# EAGLE design CHIDIYA_UD_TALKING_V8 (EAGLE 9.2.2)
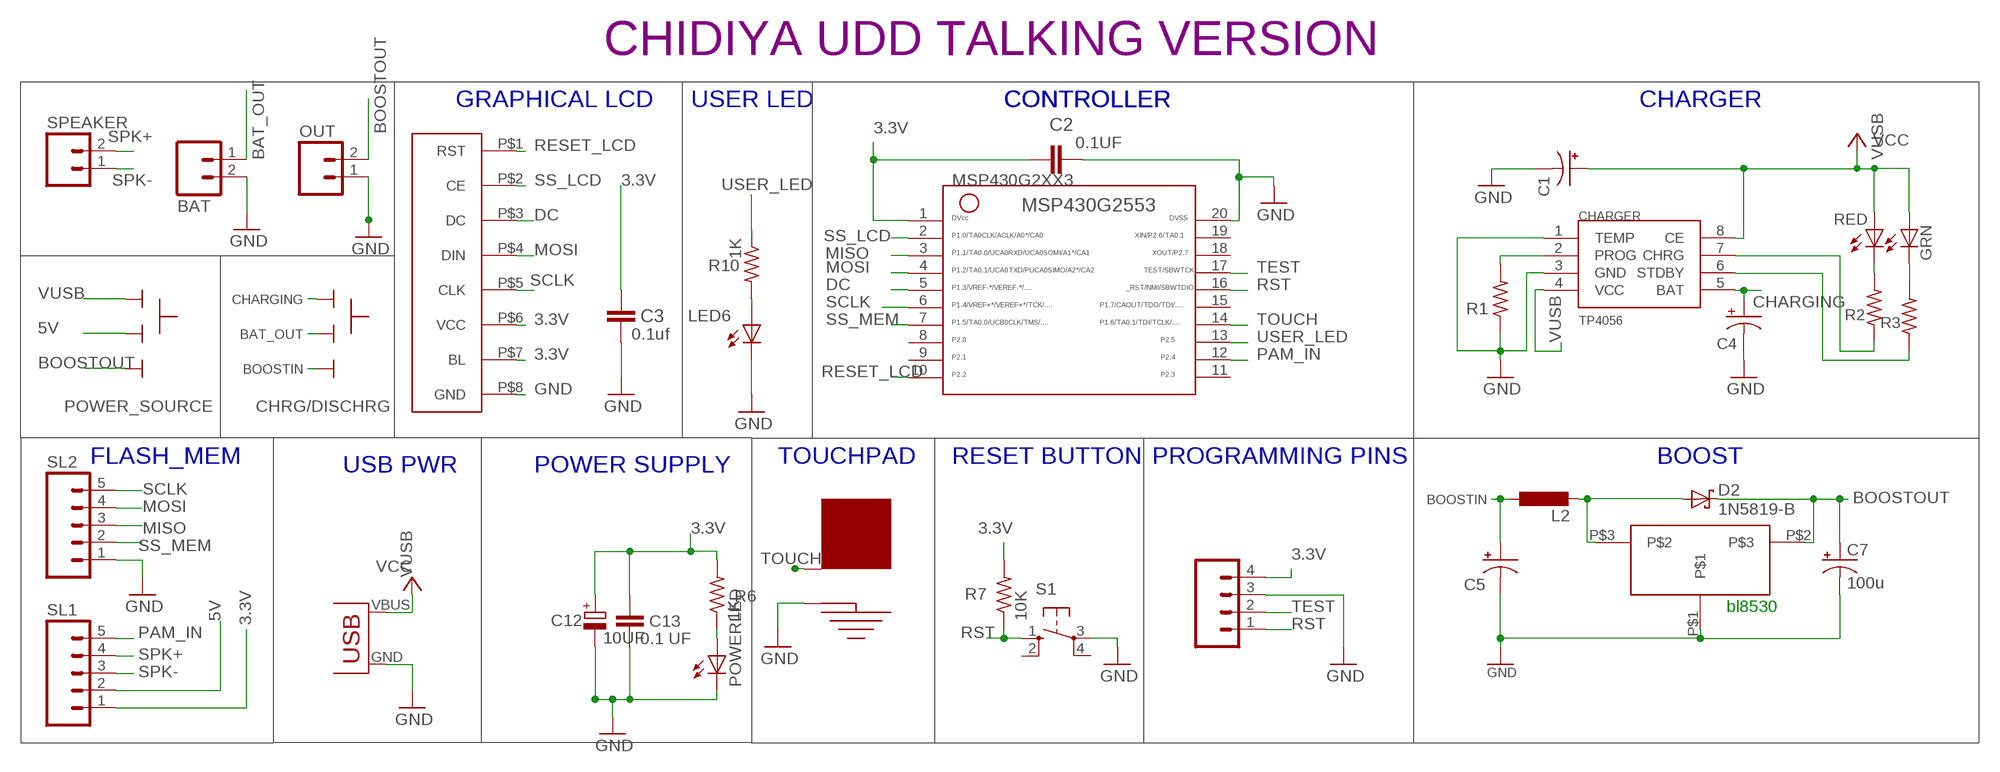
[diagram p0: schematic, sheet 1]

## Parts
BAT  M02  [02P]
BOOST  BL8530_5V  [BL8530_5V]
C1  10u  CAP_POL_10V  [C/6032-28R]
C2  0.1UF  C-EU050-025X075  [C050-025X075]
C3  0.1uf  C-EU025-025X050  [C025-025X050]
C4  10u  CAP_POL_10V  [C/6032-28R]
C5  10u  CAP_POL_10V  [C/6032-28R]
C7  100u  CAP_POL_10V  [C/6032-28R]
C12  10UF  CPOL-EUE2.5-5  [E2,5-5]
C13  0.1 UF  C-EU025-024X044  [C025-024X044]
CHARGER  TP4056  [SOP-8]
CHRG/DISCHRG  SLIDESWITCH-BIG  [BIGSWITCH]
D2  1N5819-B  [DO41-7.6]
GRN  LED3MM  [LED3MM]
L2  47uH  L-EUL4532P  [L4532P]
LED6  LED3MM  [LED3MM]
MSP430G2553  MSP430G2553DIP20  [G2553-DIP20]
OUT  M02  [02P]
POWER_SOURCE  SLIDESWITCH-BIG  [BIGSWITCH]
POWERLED  LED3MM  [LED3MM]
PROGRAM  M04  [04P]
R1  RESISTOR0805  [R0805]
R2  470  RESISTOR0805  [R0805]
R3  470  RESISTOR0805  [R0805]
R6  1K  R-US_0207/7  [0207/7]
R7  10K  R-US_0207/7  [0207/7]
R10  1K  R-US_0207/7  [0207/7]
RED  LED3MM  [LED3MM]
S1  10-XX  [B3F-10XX]
SL1  M05  [05P]
SL2  M05  [05P]
SPEAKER  M02  [02P]
TOUCH1  TOUCHPAD-20MM  [TOUCHPAD-20MM]
U$2  USB(POWER)  [USB(POWER)]
U$4  NOKIA_5110_LCD  [NOKIA_5110_MODULE]

## Nets
3.3V: C2.1 C3.1 C12.+ C13.1 MSP430G2553.1 PROGRAM.4 R6.2 R7.2 SL1.1 U$4.P$6(VCC) U$4.P$7(BL)
5V: POWER_SOURCE.2 SL1.2
BAT_OUT [Power]: BAT.1 CHRG/DISCHRG.2
BOOSTIN: C5.+ CHRG/DISCHRG.3 L2.1
BOOSTOUT [Power]: BOOST.P$2 C7.+ D2.C OUT.2 POWER_SOURCE.3
CHARGING: C4.+ CHARGER.5(BAT) CHRG/DISCHRG.1
DC: MSP430G2553.5 U$4.P$3(DC)
GND: BAT.2 BOOST.P$1 C1.- C2.2 C3.2 C4.- C5.- C7.- C12.- C13.2 CHARGER.1(TEMP) CHARGER.3(GND) LED6.K(C) MSP430G2553.20 OUT.1 POWERLED.K(C) PROGRAM.3 R1.1 S1.3(P) SL2.1 TOUCH1.GND U$2.GND U$4.P$8(GND)
MISO: MSP430G2553.3 SL2.3
MOSI: MSP430G2553.4 SL2.4 U$4.P$4(DIN)
N$5: LED6.A R10.2
N$7: CHARGER.2(PROG) R1.2
N$8: CHARGER.7(CHRG) R2.1
N$9: CHARGER.6(STDBY) R3.1
N$10: R2.2 RED.K(C)
N$11: BOOST.P$3 D2.A L2.2
N$12: POWERLED.A R6.1
N$15: GRN.K(C) R3.2
PAM_IN: MSP430G2553.12 SL1.5
RESET_LCD: MSP430G2553.10 U$4.P$1(RST)
RST: MSP430G2553.16 PROGRAM.1 R7.1 S1.1(S)
SCLK: MSP430G2553.6 SL2.5 U$4.P$5(CLK)
SPK+: SL1.4 SPEAKER.2
SPK-: SL1.3 SPEAKER.1
SS_LCD: MSP430G2553.2 U$4.P$2(CE)
SS_MEM: MSP430G2553.7 SL2.2
TEST: MSP430G2553.17 PROGRAM.2
TOUCH: MSP430G2553.14 TOUCH1.TOUCH
USER_LED: MSP430G2553.13 R10.1
VUSB [Power]: C1.+ CHARGER.4(VCC) CHARGER.8(CE) GRN.A POWER_SOURCE.1 RED.A U$2.VBUS(VCC) ; supply symbol labelled VCC
Unconnected: MSP430G2553.8 MSP430G2553.9 MSP430G2553.11 MSP430G2553.15 MSP430G2553.18 MSP430G2553.19 S1.2(S1) S1.4(P1)

## Notes on the sheet
- CHIDIYA UDD TALKING VERSION
- GRAPHICAL LCD | USER LED | CONTROLLER | CONTROLLER | CHARGER
- FLASH_MEM | TOUCHPAD | RESET BUTTON | PROGRAMMING PINS | BOOST
- USB PWR | POWER SUPPLY
- bl8530

## Library data of the parts
BAT OUT SPEAKER = CEDT_JANUARY_2015_v5:M02: AMP QUICK CONNECTOR
BOOST = PSU_TT_SMD:BL8530_5V
C1 C7 = CEDT_JANUARY_2015_v7:CAP_POL
C2 C13 = CPO:C-EU: CAPACITOR, European symbol
C3 = Arduino_Hackathon_v5:C-EU: CAPACITOR, European symbol
C4 C5 = CEDT_JANUARY_2015_v5:CAP_POL
C12 = rcl:CPOL-EU: POLARIZED CAPACITOR, European symbol; SPICEPREFIX: C
CHARGER = TP4056:TP4056
CHRG/DISCHRG POWER_SOURCE = CEDT_JANUARY_2015_v5:SLIDESWITCH
D2 = diode:1N581*: 1.0A SCHOTTKY BARRIER RECTIFIER Source: http://www.diodes.com/datasheets/ds23001.pdf
GRN RED = 01_adafruit:LED: LED OSRAM: - CHIPLED LG R971, LG N971, LY N971, LG Q971, LY Q971, LO R971, LY R971 LH N974, LH R974 LS Q976, LO Q976, LY Q976 LO Q996 - Hyper CHIPLED LW Q18S LB Q993, LB Q99A, LB R99A - SideLED LS A670, LO A670, LY A670, LG A670, LP A670 LB A673, LV A673, LT A673, LW A673 LH A674 LY A675 LS A676, LA A676, LO A676, LY A676, LW A676 LS A679, LY A679, LG A679 - Hyper Micro SIDELED® LS Y876, LA Y876, LO Y876, LY Y876 LT Y87S - SmartLED LW L88C, LW L88S LB L89C, LB L89S, LG L890 LS L89K, LO L89K, LY L89K LS L896, LA L896, LO L896, LY L896 - TOPLED LS T670, LO T670, LY T670, LG T670, LP T670 LSG T670, LSP T670, LSY T670, LOP T670, LYG T670 LG T671, LOG T671, LSG T671 LB T673, LV T673, LT T673, LW T673 LH T674 LS T676, LA T676, LO T676, LY T676, LB T676, LH T676, LSB T676, LW T676 LB T67C, LV T67C, LT T67C, LS T67K, LO T67K, LY T67K, LW E67C LS E67B, LA E67B, LO E67B, LY E67B, LB E67C, LV E67C, LT E67C LW T67C LS T679, LY T679, LG T679 LS T770, LO T770, LY T770, LG T770, LP T770 LB T773, LV T773, LT T773, LW T773 LH T774 LS E675, LA E675, LY E675, LS T675 LS T776, LA T776, LO T776, LY T776, LB T776 LHGB T686 LT T68C, LB T68C - Hyper Mini TOPLED® LB M676 - Mini TOPLED Santana® LG M470 LS M47K, LO M47K, LY M47K Source: http://www.osram.convergy.de/
L2 = rcl:L-EU: INDUCTOR, European symbol
LED6 POWERLED = CEDT_JANUARY_2015_v5:LED
MSP430G2553 = CEDT_JANUARY_2015_v5:MSP430G2553
PROGRAM = con-amp-quick:M04: AMP QUICK CONNECTOR; OC_FARNELL: unknown; OC_NEWARK: unknown
R1-R3 = CEDT_JANUARY_2015_v5:RESISTOR
R6 R7 R10 = rcl:R-US_: RESISTOR, American symbol; SPICEPREFIX: R
S1 = switch-omron:10-XX: OMRON SWITCH; MPN: B3F-1000; OC_FARNELL: 176432; OC_NEWARK: 36M3542
SL1 SL2 = con-amp-quick:M05: AMP QUICK CONNECTOR; OC_FARNELL: unknown; OC_NEWARK: unknown
TOUCH1 = modified_msp_framework_v3:TOUCHPAD
U$2 = CEDT_JANUARY_2015_v7:USB(POWER)
U$4 = CEDT_SEPTEMBER_V2:NOKIA_5110_LCD

## Net classes
0 default: width 0.356 mm
1 Power: width 0.508 mm

## Board
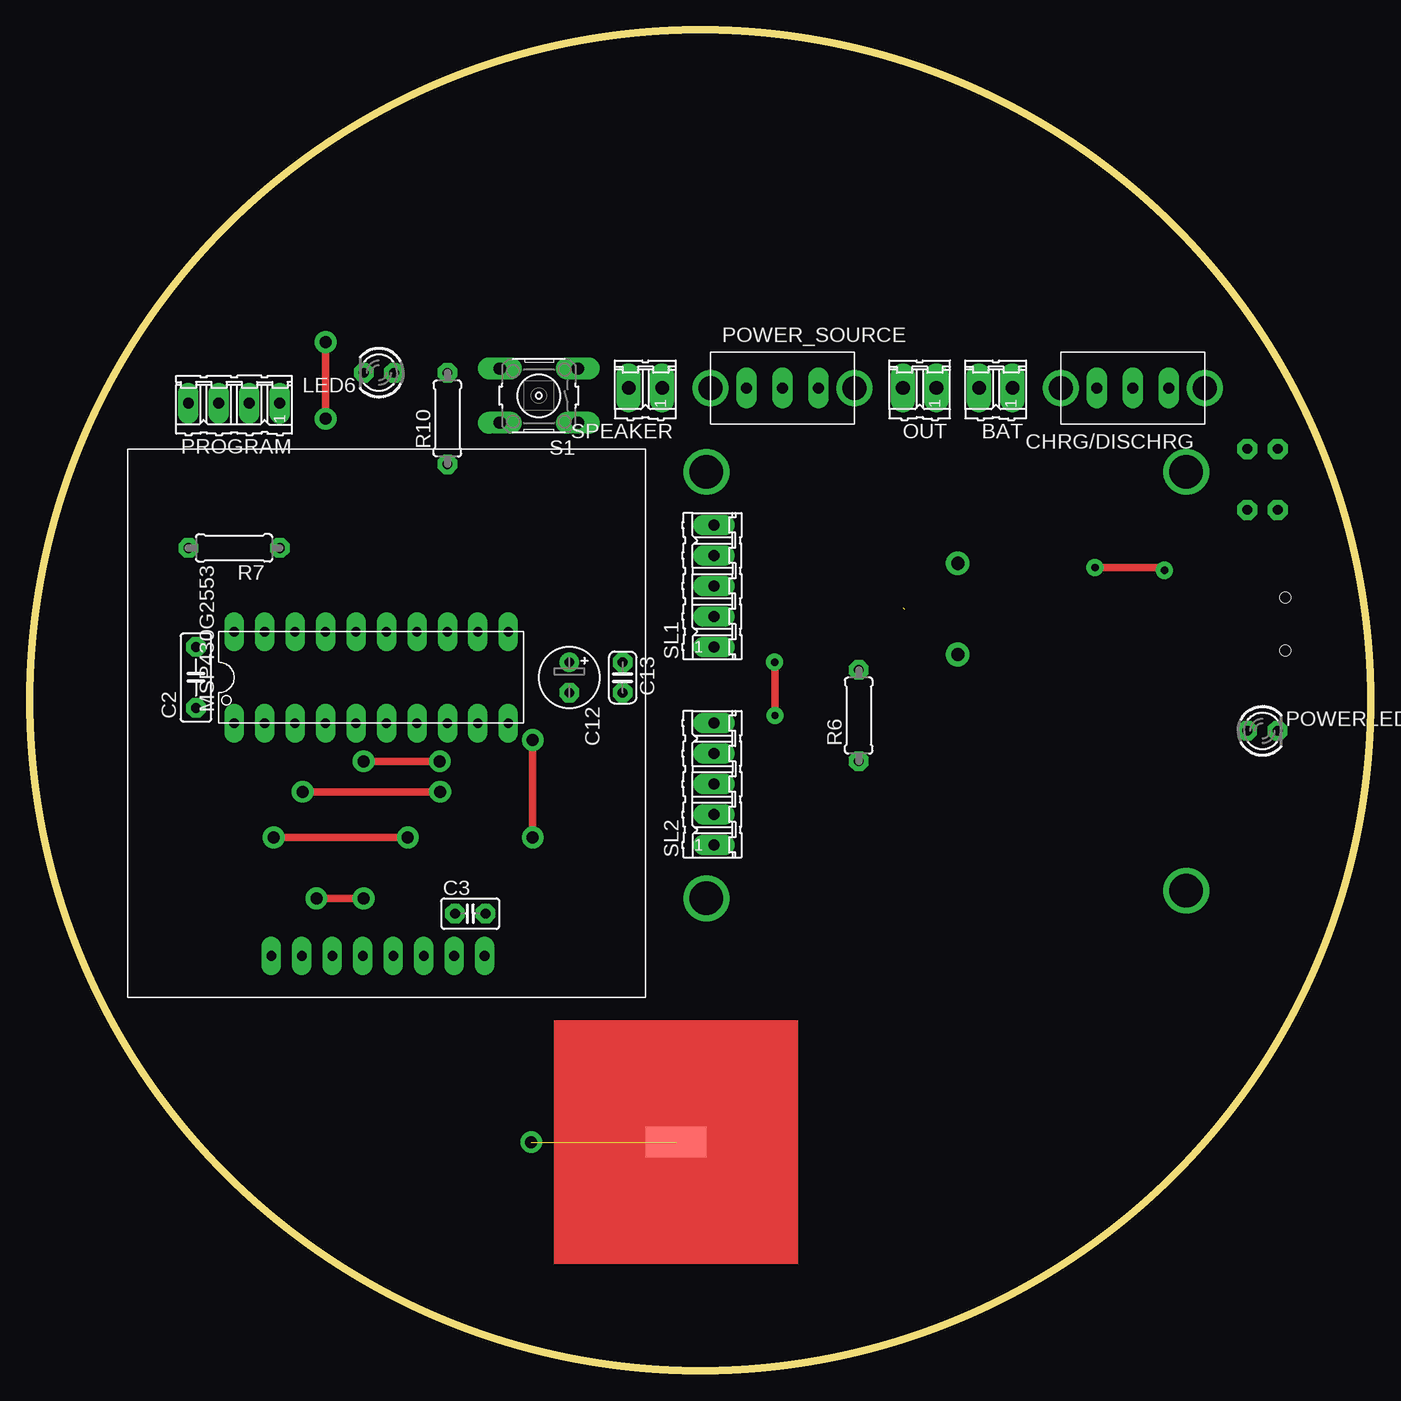
[diagram p1: board, top side]
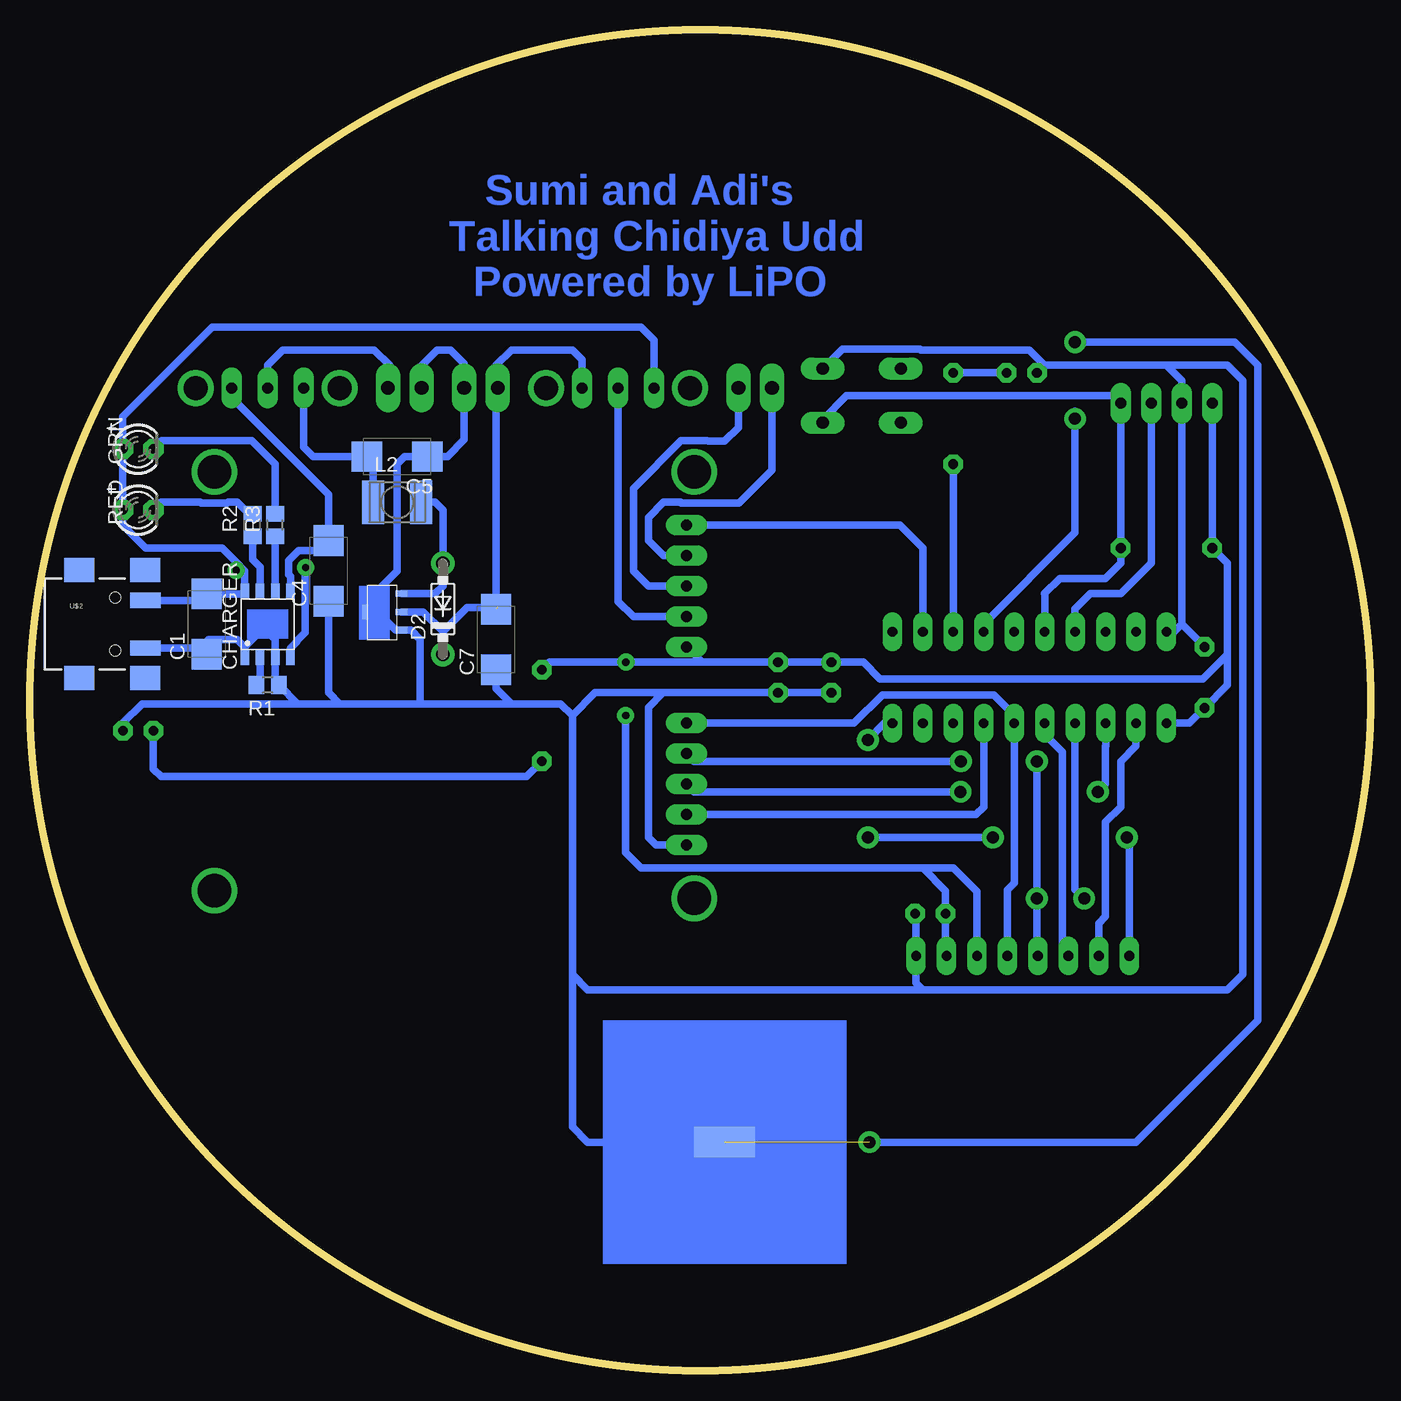
[diagram p2: board, bottom side, seen from below]

Size 111.76 x 111.76 mm. Coordinates in mm from the lower left corner, seen from the top.
Outline: circle at 55.88,55.88 radius 55.88
Copper layers (1*16): Top 0.035mm / dielectric 1.5mm / Bottom 0.035mm
Design rules "default *": minimum track width 24mil, minimum drill 24mil, track to track 16mil, track to pad 16mil, pad to pad 16mil, via to via 16mil, smd to smd 16mil, copper to edge 40mil, drill to drill 8mil, minimum pad ring 16mil, minimum via ring 16mil, stop-mask expansion 4mil, vias tented up to drill 0mil, thermal gap 10mil

### Footprints (pad centres in the part's own frame; a part is rotated, then mirrored left to right if it is on the bottom)
02P = drill 1.143 long: 1 -1.397,0; 2 1.397,0
BL8530_5V = smd 0.508 x 1.016: P$1 0.762,-0.381; P$2 2.286,-0.381; P$3 3.81,-0.381 | smd 1.27 x 0.508: P$4 2.286,2.667
C/6032-28R = smd 2.55 x 2.5: + 2.525,0; - -2.525,0
C050-025X075 = drill 0.813 octagon: 1 -2.54,0; 2 2.54,0
C025-025X050 = drill 0.813 octagon: 1 -1.27,0; 2 1.27,0
E2,5-5 = drill 0.813 pad 1.6: + -1.27,0 | drill 0.813 pad 1.6 octagon: - 1.27,0
C025-024X044 = drill 0.813 octagon: 1 -1.27,0; 2 1.27,0
SOP-8 = smd 1.3 x 0.7: 1 -2.75,1.905; 2 -2.75,0.635; 3 -2.75,-0.635; 4 -2.75,-1.905; 5 2.75,-1.905; 6 2.75,-0.635; 7 2.75,0.635; 8 2.75,1.905
BIGSWITCH = drill 0.9 long: 1 -3,0; 2 0,0; 3 3,0 | drill 2 pad 2.184: TAB1 -6,0; TAB2 6,0
DO41-7.6 = drill 1.1 pad 1.7: A 3.81,0; C -3.81,0
LED3MM = drill 0.813 pad 1.676 octagon: A -1.27,0; K 1.27,0
L4532P = smd 1.8 x 3.6: 1 -2,0; 2 2,0
LED3MM' = drill 0.813 octagon: A -1.27,0; K 1.27,0
G2553-DIP20 = drill 0.813 long: 1 -10.165,-3.81; 2 -7.625,-3.81; 3 -5.085,-3.81; 4 -2.545,-3.81; 5 -0.005,-3.81; 6 2.535,-3.81; 7 5.075,-3.81; 8 7.615,-3.81; 9 10.155,-3.81; 10 12.695,-3.81; 11 12.695,3.81; 12 10.155,3.81; 13 7.615,3.81; 14 5.075,3.81; 15 2.535,3.81; 16 -0.005,3.81; 17 -2.545,3.81; 18 -5.085,3.81; 19 -7.625,3.81; 20 -10.165,3.81
04P = drill 0.914 long: 1 -3.81,0; 2 -1.27,0; 3 1.27,0; 4 3.81,0
R0805 = smd 1.3 x 1.5: 1 -0.95,0; 2 0.95,0
0207/7 = drill 0.813 octagon: 1 -3.81,0; 2 3.81,0
B3F-10XX = drill 1.016 long: 1 -3.251,2.261; 2 3.251,2.261; 3 -3.251,-2.261; 4 3.251,-2.261
05P = drill 0.914 long: 1 -5.08,0; 2 -2.54,0; 3 0,0; 4 2.54,0; 5 5.08,0
TOUCHPAD-20MM = smd 5.08 x 2.54 bottom: GND 0,0 | smd 5.08 x 2.54: TOUCH 0,0
USB(POWER) = smd 2.54 x 1.27: GND 2.5,-1.981; VBUS 2.5,1.981 | smd 2.5 x 2: GND@1 -3,-4.5; GND@2 -3,4.5; GND@3 2.5,4.5; GND@4 2.5,-4.5 | hole 0.9: 0,2.2; 0,-2.2
NOKIA_5110_MODULE = drill 0.8 long: P$1 11.989,3.454; P$2 14.529,3.454; P$3 17.069,3.454; P$4 19.609,3.454; P$5 22.149,3.454; P$6 24.689,3.454; P$7 27.229,3.454; P$8 29.769,3.454

### Placement (x,y rotation side)
BAT  80.52,81.91 180 top
BOOST  81.15,60.96 90 bottom
C1  97.03,62.23 90 bottom
C2  13.84,57.79 90 top
C3  36.7,38.1 0 top
C4  86.87,66.68 90 bottom
C5  81.15,76.2 180 bottom
C7  72.9,60.96 90 bottom
C12  44.96,57.79 270 top
C13  49.4,57.79 270 top
CHARGER  91.95,62.23 90 bottom
CHRG/DISCHRG  91.95,81.91 180 top
D2  77.34,63.5 90 bottom
GRN  102.74,76.84 0 bottom
L2  81.15,72.39 0 bottom
LED6  LED3MM  [LED3MM']  29.08,83.19 180 top
MSP430G2553  27.18,57.79 0 top
OUT  74.17,81.91 180 top
POWER_SOURCE  62.74,81.91 0 top
POWERLED  LED3MM  [LED3MM']  102.74,53.34 0 top
PROGRAM  17.02,80.65 180 top
R1  91.95,57.15 180 bottom
R2  93.22,70.49 90 bottom
R3  91.31,70.49 90 bottom
R6  69.09,54.61 90 top
R7  17.02,68.58 180 top
R10  34.8,79.38 90 top
RED  102.74,71.75 0 bottom
S1  42.42,81.28 180 top
SL1  57.02,65.41 90 top
SL2  57.02,48.9 90 top
SPEAKER  51.31,81.91 180 top
TOUCH1  53.85,19.05 0 top
U$2  104.65,62.23 0 bottom
U$4  8.13,31.12 0 top

### Tracks (layer width: path | path; a pad name or v marks a point on that pad's centre or on a via)
3.3V  (via drill 0.61)
  Top 0.61: v62.1,54.61 62.1,59.05 v62.08,59.05
  Bottom 0.61: PROGRAM.4 R7.2 11.94,67.31 11.94,59.69 | 11.94,59.69 11.94,57.15 C2.1 15.11,53.98 MSP430G2553.1 | 55.75,59.05 C13.1 C12.+ 42.29,59.05 40.89,57.66 13.97,57.66 11.94,59.69 | 55.75,59.05 SL1.1 | v62.08,59.05 62.1,59.08 | 37.34,41.91 35.43,40.01 C3.1 35.43,34.65 U$4.P$7 | 37.34,41.91 60.83,41.91 62.1,43.18 v62.1,54.61 | U$4.P$6 32.82,39.93 34.8,41.91 37.34,41.91 | v62.08,59.05 55.75,59.05 | R6.2 68.45,59.05 v62.08,59.05
5V
  Bottom 0.61: POWER_SOURCE.2 62.74,64.13 61.47,62.87 SL1.2
BAT_OUT
  Bottom 0.61: CHRG/DISCHRG.2 91.95,83.82 90.68,85.09 83.06,85.09 81.79,83.82 81.79,82.04 BAT.1
BOOSTIN
  Bottom 0.61: CHRG/DISCHRG.3 88.95,77.01 88.14,76.2 C5.+ 83.15,75.68 L2.1
BOOSTOUT  (1 unrouted)
  Bottom 0.61: 77.34,61.59 78.99,63.25 BOOST.P$2 | D2.C 77.34,61.59 | 77.34,61.59 75.33,63.61 73.03,63.61 C7.+ 72.9,81.79 | 72.66,63.5 72.77,63.61 | 72.9,81.79 OUT.2 | POWER_SOURCE.3 65.74,84.28 66.55,85.09 71.63,85.09 72.9,83.82 72.9,81.79
CHARGING
  Bottom 0.61: CHRG/DISCHRG.1 94.95,81.1 86.87,73.03 C4.+ 86.87,69.09 87.59,68.37 89.38,68.37 90.21,67.53 90.21,66.35 90.04,66.19 CHARGER.5
DC
  Bottom 0.61: U$4.P$3 25.72,35.09 25.72,51.56 27.17,53.02 MSP430G2553.5
GND
  Bottom 0.61: 15.75,62.23 PROGRAM.3 15.75,82.55 17.02,83.82 | 15.75,62.23 C2.2 | TOUCH1.GND 65.28,19.05 66.55,20.32 66.55,33.02 | 66.55,33.02 66.55,54.61 | C12.- C13.2 58.98,56.52 | SL2.1 59.56,43.82 60.2,44.45 60.2,55.3 58.98,56.52 | 27.18,83.82 LED6.K | 15.75,62.23 16.38,61.59 MSP430G2553.20 | C3.2 37.9,38.02 U$4.P$8 37.9,32.31 37.34,31.75 | 17.02,83.82 27.18,83.82 | 37.34,31.75 11.94,31.75 10.67,33.02 10.67,82.55 11.94,83.82 17.02,83.82 | 58.98,56.52 64.64,56.52 66.55,54.61 | 85.94,55.59 79.25,55.59 | 79.25,55.59 71.63,55.59 | C7.- 72.9,56.86 71.63,55.59 | 79.25,55.59 79.25,60.96 80.01,61.72 BOOST.P$1 81.28,61.72 81.79,62.23 82.42,62.87 82.42,65.41 81.15,66.68 81.15,75.56 80.52,76.2 C5.- 76.96,76.2 75.56,77.6 OUT.1 75.56,83.95 76.71,85.09 77.83,85.09 79.12,83.79 BAT.2 | 93.85,60.33 93.85,60.32 | 93.85,60.32 CHARGER.1 | C4.- 86.87,56.52 85.94,55.59 | 93.85,60.33 92.46,61.72 92.08,61.72 91.31,60.96 CHARGER.3 91.31,57.47 R1.1 89.44,55.59 | 93.86,60.32 93.85,60.32 | 89.44,55.59 85.94,55.59 | 71.63,55.59 67.53,55.59 66.55,54.61 | S1.3 44.04,85.17 37.58,85.17 37.5,85.09 28.45,85.09 27.18,83.82 | 89.44,55.59 102.4,55.59 104.01,53.98 POWERLED.K | 37.34,31.75 65.28,31.75 66.55,33.02 | U$2.GND 97.57,60.25 | 97.57,60.25 C1.- | 97.57,60.25 96.86,60.96 94.49,60.96 93.85,60.33
MISO  (via drill 1)
  Top 0.61: v34.18,48.26 v22.73,48.26
  Bottom 0.61: MSP430G2553.3 22.09,52.07 22.1,52.07 22.1,48.9 v22.73,48.26 | v34.18,48.26 56.39,48.26 SL2.3
MOSI  (via drill 1)
  Top 0.61: v23.88,39.37 v27.81,39.37 | v34.16,50.8 v27.81,50.8
  Bottom 0.61: MSP430G2553.4 24.64,40.13 v23.88,39.37 | v34.16,50.8 56.39,50.8 SL2.4 | v27.81,50.8 v27.81,39.37 27.81,34.65 U$4.P$4
N$2  (via drill 2.79)
  other vias: 56.39,39.37
N$3  (via drill 2.79)
  other vias: 96.39,40.01
N$4  (via drill 2.79)
  other vias: 96.39,74.93
N$5
  Bottom 0.61: LED6.A R10.2
N$6  (via drill 2.79)
  other vias: 56.39,74.93
N$7
  Bottom 0.61: CHARGER.2 92.58,57.47 R1.2
N$8
  Bottom 0.61: CHARGER.7 92.58,66.99 93.22,67.62 R2.1
N$9
  Bottom 0.61: CHARGER.6 R3.1
N$10
  Bottom 0.61: R2.2 93.53,71.44 94.49,72.39 95.23,72.39 95.31,72.31 97.48,72.31 97.55,72.39 100.84,72.39 RED.K
N$11
  Bottom 0.61: L2.2 77.98,72.39 77.34,71.75 D2.A 77.34,65.41 77.98,64.77 BOOST.P$3
N$12
  Bottom 0.61: R6.1 70.36,49.53 100.84,49.53 101.47,50.16 POWERLED.A
N$15
  Bottom 0.61: R3.2 91.31,75.56 93.29,77.55 100.76,77.55 GRN.K
PAM_IN
  Bottom 0.61: MSP430G2553.12 37.33,68.58 39.24,70.49 SL1.5
RESET_LCD  (via drill 1, 1 pad 1)
  Top 0.61: v20.32,44.45 v31.5,44.45 | v41.91,44.45 v41.91,52.58
  Bottom 0.61: v31.5,44.45 v41.91,44.45 | v20.32,44.45 20.12,44.25 U$4.P$1 | MSP430G2553.10 40.51,53.98 v41.91,52.58
RST
  Bottom 0.61: MSP430G2553.16 27.17,64.77 27.18,64.77 25.91,66.04 22.1,66.04 20.83,67.31 R7.1 PROGRAM.1 21.46,81.28 43.69,81.28 45.67,79.3 S1.1
SCLK
  Bottom 0.61: SL2.5 43.05,53.98 40.72,56.31 31.42,56.31 29.71,54.61 MSP430G2553.6 29.71,40.65 30.28,40.08 U$4.P$5
SPK+
  Bottom 0.61: SPEAKER.2 49.91,75.06 52.65,72.31 57.47,72.31 57.55,72.39 58.93,72.39 60.2,71.12 60.2,69.22 58.93,67.94 SL1.4
SPK-
  Bottom 0.61: SPEAKER.1 52.7,78.61 53.85,77.47 55.23,77.47 55.3,77.55 57.47,77.55 61.47,73.55 61.47,66.68 60.2,65.41 SL1.3
SS_LCD
  Bottom 0.61: MSP430G2553.2 19.55,52.08 20.83,50.8 20.83,46.99 22.1,45.72 22.1,37.85 22.66,37.29 U$4.P$2
SS_MEM
  Bottom 0.61: SL2.2 34.8,46.36 34.16,46.36 32.89,46.36 32.25,47 MSP430G2553.7
TEST
  Bottom 0.61: PROGRAM.2 18.29,67.31 20.83,64.77 23.37,64.77 24.64,63.5 24.64,62.23 24.63,62.23 MSP430G2553.17
TOUCH  (via drill 1, 1 pad 1.68)  (1 unrouted)
  Top 0.61: v24.64,79.35 v24.64,85.75
  Bottom 0.61: MSP430G2553.14 32.25,62.23 24.64,69.85 v24.64,79.35 24.64,80.01 | v41.78,19.05 19.56,19.05 9.4,29.21 9.4,83.82 11.33,85.75 v24.64,85.75
USER_LED
  Bottom 0.61: MSP430G2553.13 R10.1
VUSB  (via drill 0.61)
  Top 0.61: v88.79,66.94 94.35,66.94 v94.57,66.72
  Bottom 0.61: POWER_SOURCE.1 59.74,85.9 60.83,87 96.56,87 104.01,79.54 GRN.A RED.A 104.01,70.49 102.11,68.58 95.76,68.58 94.57,67.4 | U$2.VBUS 97.57,64.21 C1.+ 94.08,64.75 CHARGER.8 93.85,66.68 94.57,67.4 | CHARGER.4 90.04,60.23 89.54,60.73 89.54,60.83 88.83,61.54 88.83,66.9 v88.79,66.94 | v94.57,66.72 94.57,67.4
(copper drawn outside any net)
  shapes: Bottom area x1

### Text on the board
Bottom: Sumi and Adi's / Talking Chidiya Udd / Powered by LiPO